# EAGLE design LoLin32-Lite-Lora (EAGLE 7.7.0)
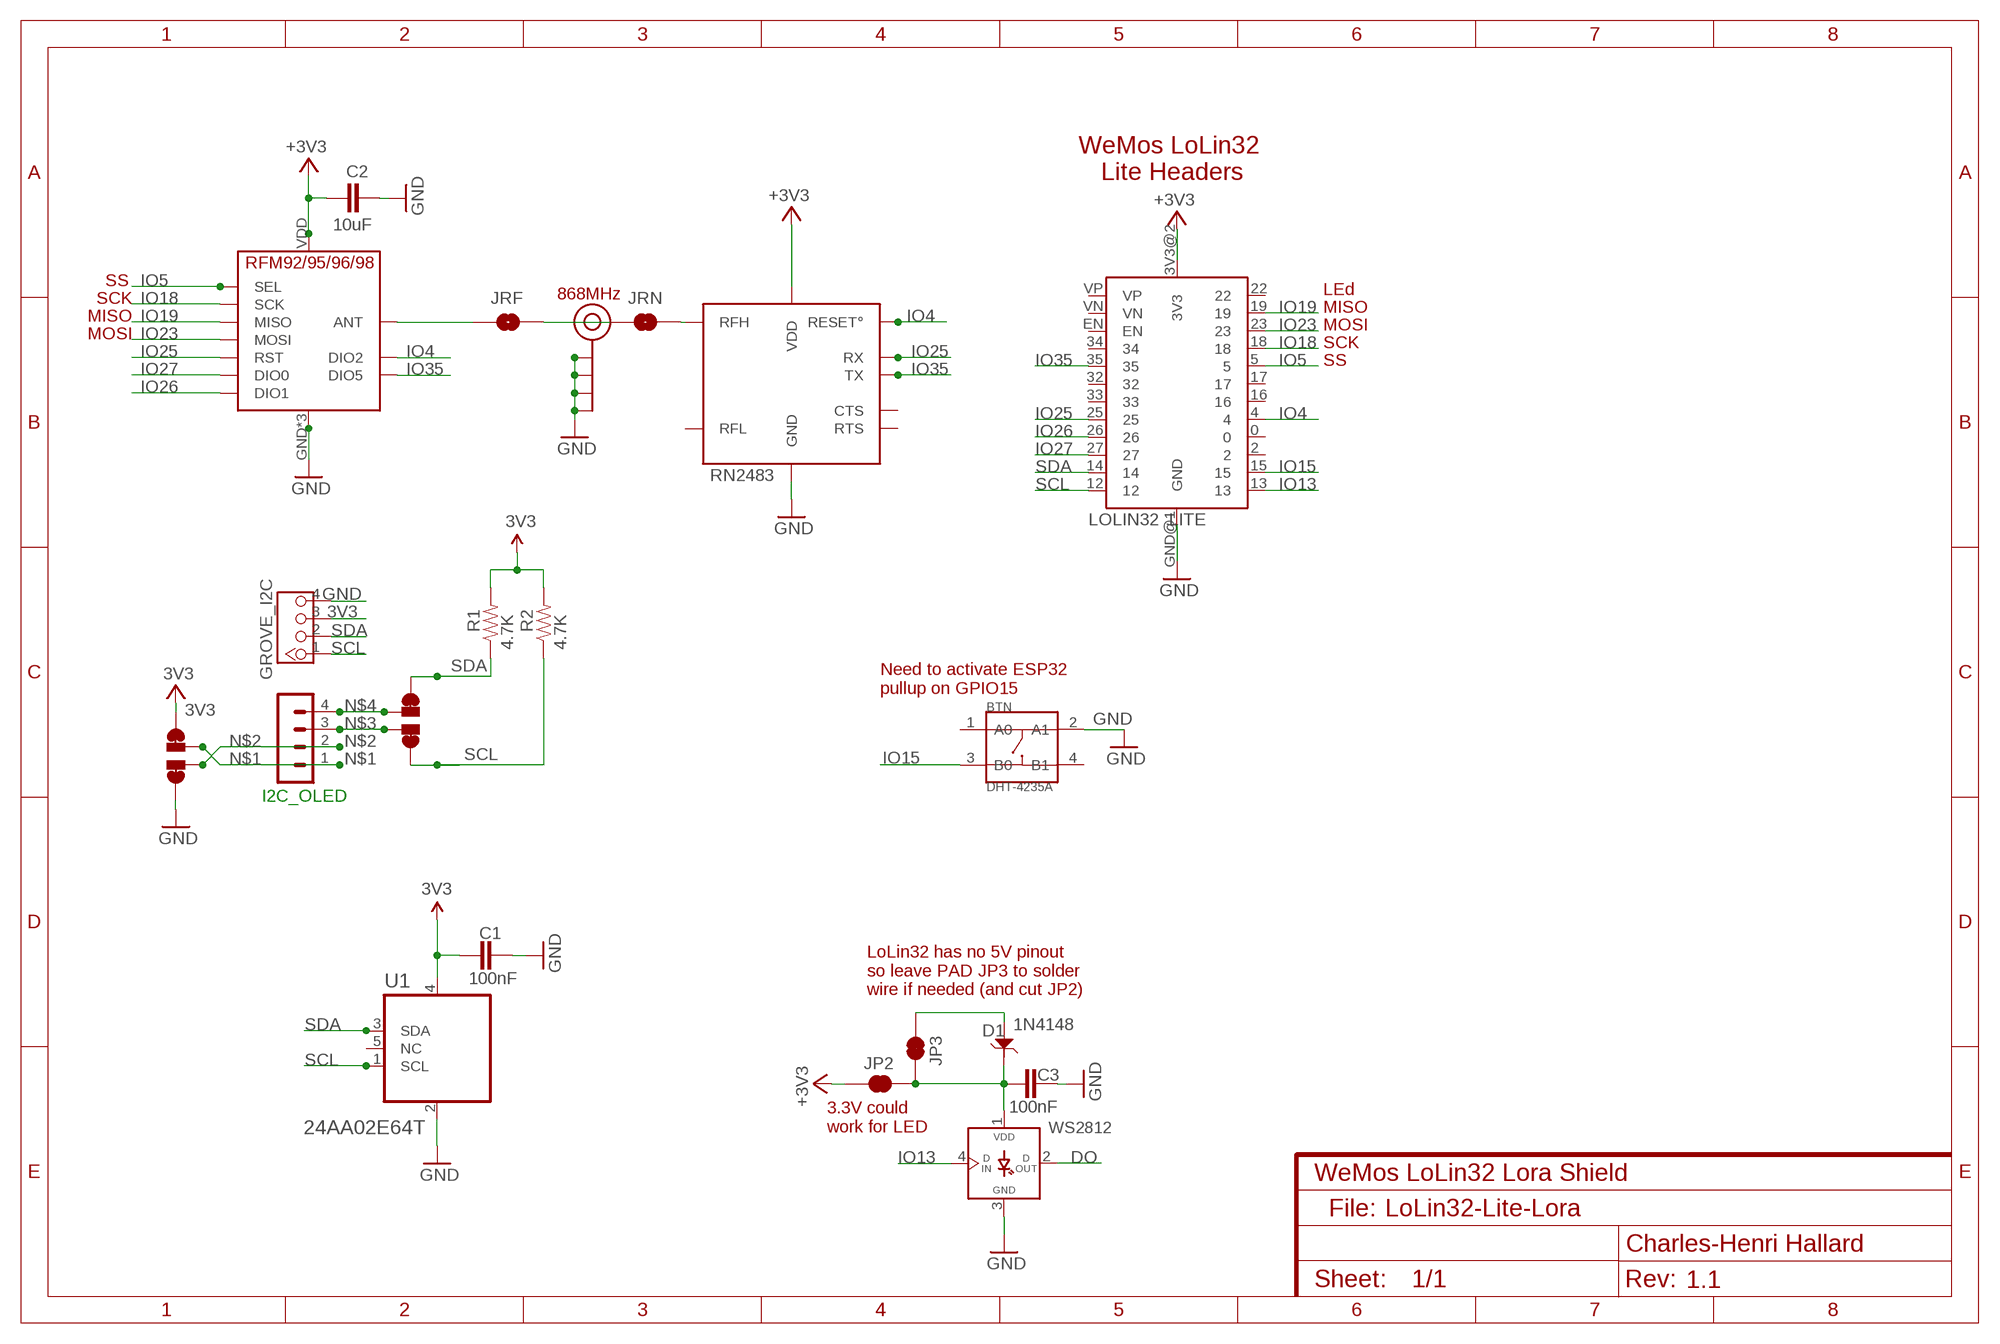
[diagram p0: schematic, sheet 1]
NAME (FRAME-A4L): CNAME: WeMos LoLin32 Lora Shield; CREVISION: 1.1; DESIGNER: Charles-Henri Hallard

## Parts
BTN  DHT-4235A  SMD-BUTTON-TOP-DHT-4235A(4P-4.2X3.2MM)  [SW4-SMD-4.2X3.2X2.5MM]
C1  100nF  CAP0805-CAP  [0805-CAP]
C2  10uF  CAP0805-CAP-LARGEPADS  [0805-CAP-LARGEPADS]
C3  100nF  CAP0805-CAP  [0805-CAP]
D1  1N4148  D-ESD-2P-CESD5V0D1  [SOD123-2.7X1.6]
GROVE_I2C  4P-2.0  GROVE-CONNECTOR-DIP(4P-2.0)  [HW4-2.0]
I2C_OLED  CON_HEADER_1X04'NO_LOCK'  [1X04_NO_LOCK]
J$2  ANTENNATINY  [SMA_UFL_PAD_TINY]
JP2  RXLED  JUMPER-PAD-2-NC_BY_TRACE  [PAD-JUMPER-2-NC_BY_TRACE_YES_SILK]
JP3  JUMPER-PAD-2-NC_BY_TRACE  [PAD-JUMPER-2-NC_BY_TRACE_YES_SILK]
JRF  JUMPER-PAD-2-NO  [PAD-JUMPER-2-NO_NO_SILK]
JRN  JUMPER-PAD-2-NO  [PAD-JUMPER-2-NO_NO_SILK]
R1  4.7K  RESISTOR0805-RES  [0805-RES]
R2  4.7K  RESISTOR0805-RES  [0805-RES]
U1  24AA02E64T  24AA02E64T-I/OT  [SOT95P270X145-5N]
U$1  LOLIN32 LITE  LOLIN32_LITELITE  [LOLIN32_LITE]
U$2  PAD-JUMPER-SWAPSWAP  [PAD-JUMPER-SWAP]
U$3  PAD-JUMPER-SWAPSWAP  [PAD-JUMPER-SWAP]
U$5  RFM95  [RFM95]
U$7  RN2483  RN2483_NOGPIO868  [RN2483_NOGPIO_868]
WS2812  WS2812B  WS2812BSMD  [WS2812B]

## Nets
3V3: C1.1 C2.2 GROVE_I2C.3 JP2.2 R1.2 R2.2 U1.4(VCC) U$1.3V3@2(3V3) U$2.4 U$2.44 U$5.VDD(VCC) U$7.VDD U$7.VDD2(VDD) ; supply symbol labelled +3V3
5V: D1.1 JP3.2
DO: WS2812.2(DOUT)
GND: BTN.2(A1) C1.2 C2.1 C3.2 GROVE_I2C.4 J$2.GND1(GND) J$2.GND2(GND) J$2.GND3(GND) J$2.GND4(GND) U1.2(VSS) U$1.GND@1(GND) U$2.1 U$2.11 U$5.GND U$5.GND1(GND) U$5.GND2(GND) U$7.GND U$7.GND3(GND) U$7.GND4(GND) U$7.GND7(GND) U$7.GND9(GND) U$7.GND11(GND) U$7.GND12(GND) WS2812.3(GND)
IO4: U$1.4 U$5.DIO2 U$7.RESET°
IO5: U$1.5 U$5.NSS(SEL)
IO13: U$1.13 WS2812.4(DIN)
IO15: BTN.3(B0) U$1.15
IO18: U$1.18 U$5.SCK
IO19: U$1.19 U$5.MISO
IO23: U$1.23 U$5.MOSI
IO25: U$1.25 U$5.RST U$7.UART_RX(RX)
IO26: U$1.26 U$5.DIO1
IO27: U$1.27 U$5.DIO0
IO35: U$1.35 U$5.DIO5 U$7.UART_TX(TX)
N$1: I2C_OLED.1 U$2.3
N$2: I2C_OLED.2 U$2.2
N$3: I2C_OLED.3 U$3.2
N$4: I2C_OLED.4 U$3.3
N$5: JRN.2 U$7.RFH
N$6: JRF.1 U$5.ANT
N$7: J$2.ANT1(SIGNAL) J$2.ANT2(SIGNAL) J$2.ANT3(SIGNAL) JRF.2 JRN.1
SCL: GROVE_I2C.1 R2.1 U1.1(SCL) U$1.12 U$3.1 U$3.11
SDA: GROVE_I2C.2 R1.1 U1.3(SDA) U$1.14 U$3.4 U$3.44
VLED: C3.1 D1.2 JP2.1 JP3.1 WS2812.1(VDD)
Unconnected: BTN.1(A0) BTN.4(B1) U1.5(NC) U$1.0 U$1.2 U$1.16 U$1.17 U$1.22 U$1.32 U$1.33 U$1.34 U$1.EN U$1.VN U$1.VP U$7.RFL U$7.UART_CTS(CTS) U$7.UART_RTS(RTS)

## Notes on the sheet
- WeMos LoLin32 
  Lite Headers
- SS
- 868MHz | LEd
- SCK
- MISO
- MISO
- MOSI
- MOSI
- SCK
- SS
- Need to activate ESP32
  pullup on GPIO15
- LoLin32 has no 5V pinout
  so leave PAD JP3 to solder
  wire if needed (and cut JP2)
- 3.3V could
  work for LED
- File:

## Library data of the parts
BTN = Switch-2016:SMD-BUTTON-TOP-DHT-4235A(4P-4.2X3.2MM): 311020045; MPN: DHT-4235A
C1-C3 = _c2h:CAP: Capacitor Standard 0603 ceramic capacitor, and 0.1" leaded capacitor.
D1 = Seeed-Discrete:D-ESD-2P: Diodes for Protectiong against ESD
GROVE_I2C = _c2h:GROVE-CONNECTOR-DIP(4P-2.0): 320110033
I2C_OLED = _c2h:CON_HEADER_1X04
J$2 = _c2h:ANTENNA: SMA Antenna Connector End launch SMA connector. The paste layer has been removed so that the connector can be hand soldered onto the board after reflow.
JP2 JP3 = SparkFun-Passives:JUMPER-PAD-2-NC_BY_TRACE
JRF JRN = SparkFun-Passives:JUMPER-PAD-2-NO
R1 R2 = _c2h:RESISTOR: Resistor Basic schematic elements and footprints for 0603, 1206, and PTH resistors.
U1 = Microchip-24AA02E64T:24AA02E64T-I/OT: 2K I2C™ Serial EEPROMs, SOT23-5; MPN: 24AA02E64T-I/OT; OC_FARNELL: 2345567; OC_NEWARK: 01X0461; PACKAGE: SOT23-5; SUPPLIER: Microchip
U$1 = _c2h:LOLIN32_LITE
U$2 U$3 = _c2h:PAD-JUMPER-SWAP
U$5 = _c2h:RFM95
U$7 = _c2h:RN2483_NOGPIO
WS2812 = _c2h:WS2812B

## Net classes
0 default: width 0.203 mm, drill 0.356 mm, clearance 0.152 mm
1 power: width 0.203 mm, clearance 0.152 mm

## Board
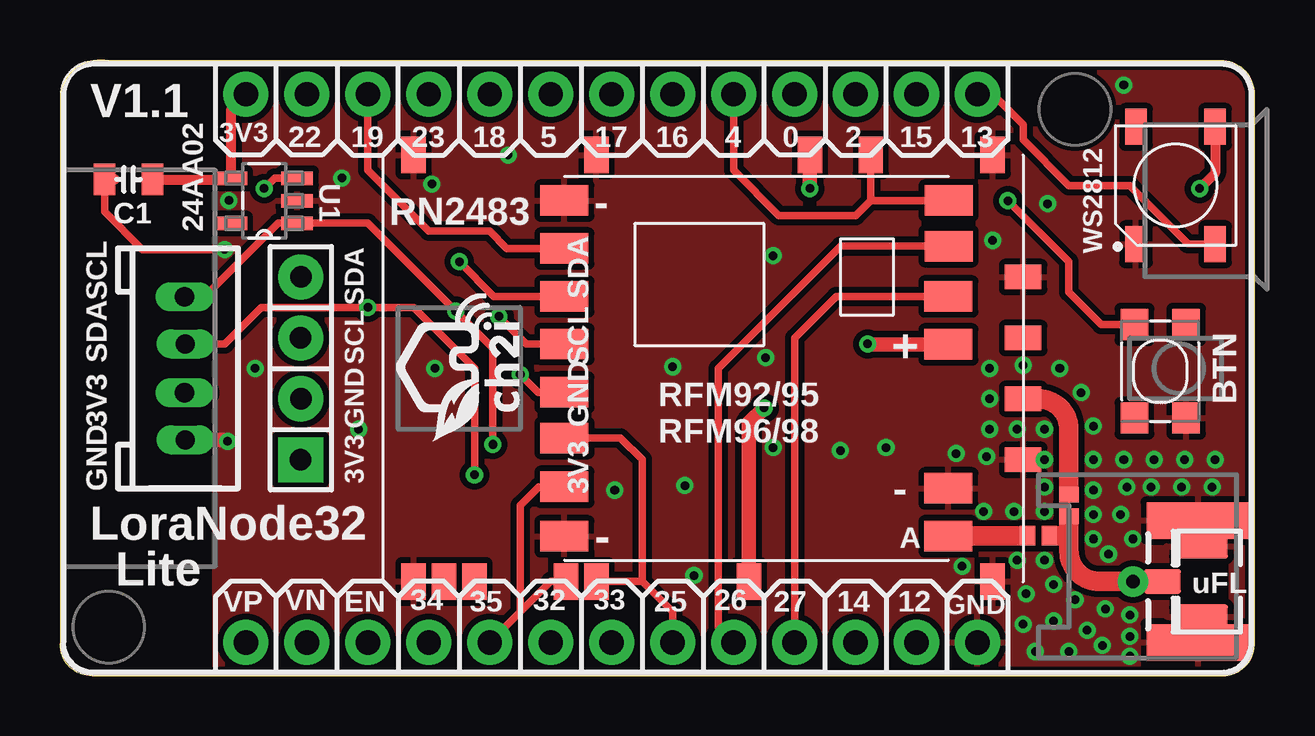
[diagram p1: board, top side]
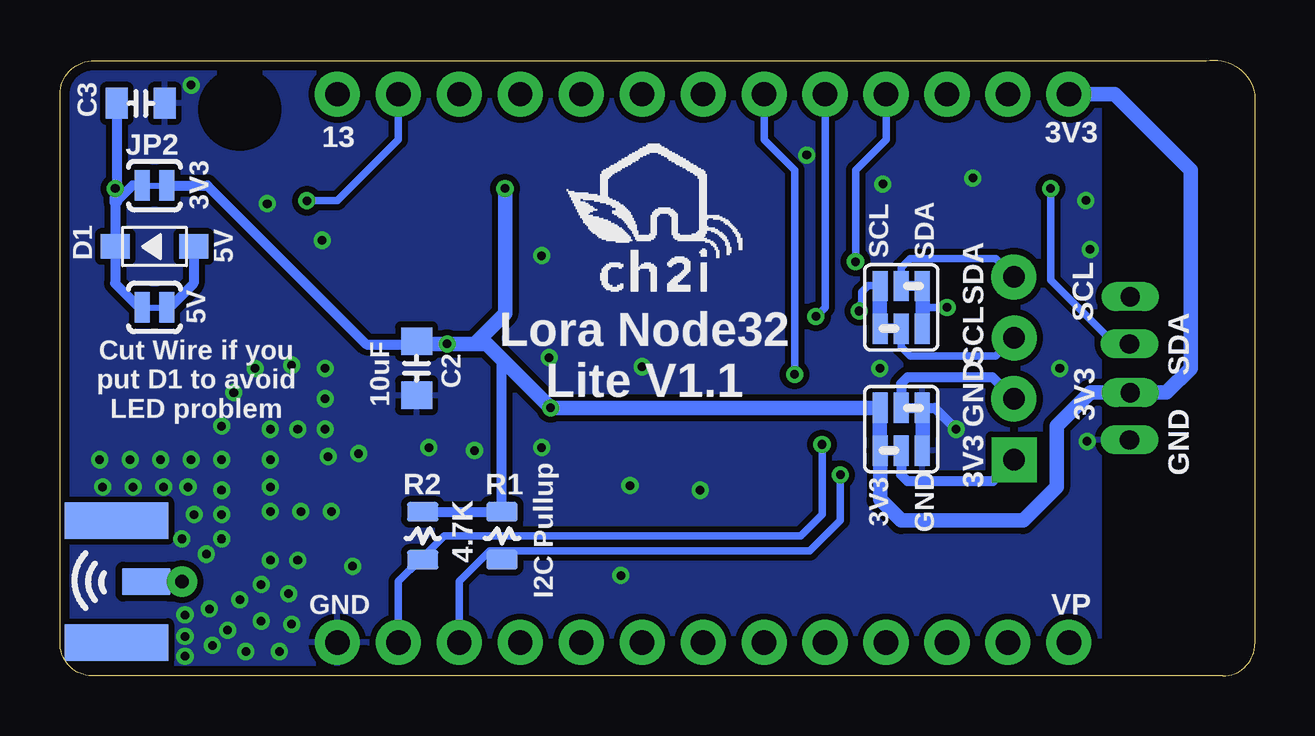
[diagram p2: board, bottom side, seen from below]

Size 49.78 x 25.68 mm. Coordinates in mm from the lower left corner, seen from the top.
Outline: 48.36,25.65 2.03,25.65 arc90 0,24.26 0,1.33 arc90 1.33,0 48.45,0 arc90 49.78,1.4 49.78,24.26 arc90 48.36,25.65
Copper layers (1*16): Top 0.0356mm / dielectric 1.5011mm / Bottom 0.0356mm
Design rules "PCBs_io": minimum track width 6mil, minimum drill 13mil, track to track 6mil, track to pad 6mil, pad to pad 6mil, via to via 6mil, smd to smd 6mil, copper to edge 15mil, drill to drill 6mil, minimum pad ring 7mil, minimum via ring 7mil, stop-mask expansion 3mil, vias tented up to drill 40mil, thermal gap 10mil
tRestrict: area 0.8,0.8 to 3.3,3.3; area 41,22.4 to 43.6,24.9
bRestrict: area 0.8,0.8 to 3.3,3.3; area 41,22.4 to 43.6,24.9

### Footprints (pad centres in the part's own frame; a part is rotated, then mirrored left to right if it is on the bottom)
SW4-SMD-4.2X3.2X2.5MM = smd 1.3 x 1.15: 1 -1.95,1.075; 2 1.95,1.075; 3 -1.95,-1.075; 4 1.95,-1.075
0805-CAP = smd 0.902 x 1.3: 1 -1,0; 2 1,0
0805-CAP-LARGEPADS = smd 1.156 x 1.3: 1 -1.127,0; 2 1.127,0
SOD123-2.7X1.6 = smd 1.2 x 1.02: 1 -1.635,0; 2 1.635,0
HW4-2.0 = drill 0.8 pad 1.143 long: 1 -2.985,-0.015; 2 -1.016,0.016; 3 1.016,-0.016; 4 2.985,0.015
1X04_NO_LOCK = drill 0.9 pad 1.88 square: 1 -3.816,-0.121 | drill 0.9 pad 1.88: 2 -1.27,-0.133; 3 1.27,-0.121; 4 3.81,-0.133
SMA_UFL_PAD_TINY = smd 1.524 x 1.016: ANT1 -3.843,0 | drill 0.559 pad 1.27: ANT2 -5.08,0 | smd 2.032 x 1.143 bottom: ANT3 -3.589,0 | smd 2.2 x 1.016: GND1 -2.223,1.47; GND2 -2.223,-1.47 | smd 4.318 x 1.524: GND3 -2.349,-2.54; GND4 -2.349,2.54 | smd 4.318 x 1.524 bottom: GND5 -2.349,2.54; GND6 -2.349,-2.54
PAD-JUMPER-2-NC_BY_TRACE_YES_SILK = smd 0.635 x 1.27: 1 -0.508,0; 2 0.508,0
PAD-JUMPER-2-NO_NO_SILK = smd 0.635 x 0.813: 1 -0.45,0; 2 0.45,0
0805-RES = smd 0.8 x 1.3: 1 -1,0; 2 1,0
SOT95P270X145-5N = smd 1.321 x 0.559: 1 -1.372,0.94; 2 -1.372,0; 3 -1.372,-0.94; 4 1.372,-0.94; 5 1.372,0.94
LOLIN32_LITE = drill 1.016 pad 1.88: 0 11.43,-0.635; 2 11.43,-3.175; 3V3@2 11.43,22.225; 4 11.43,1.905; 5 11.43,9.525; 12 -11.43,-5.715; 13 11.43,-8.255; 14 -11.43,-3.175; 15 11.43,-5.715; 16 11.43,4.445; 17 11.43,6.985; 18 11.43,12.065; 19 11.43,17.145; 22 11.43,19.685; 23 11.43,14.605; 25 -11.43,4.445; 26 -11.43,1.905; 27 -11.43,-0.635; 32 -11.43,9.525; 33 -11.43,6.985; 34 -11.43,14.605; 35 -11.43,12.065; EN -11.43,17.145; GND@1 -11.43,-8.255; VN -11.43,19.685; VP -11.43,22.225
PAD-JUMPER-SWAP = smd 0.635 x 1.27: 1 -0.876,0.889; 2 0,-0.889; 3 0,0.889; 4 0.876,-0.889; 11 -0.876,-0.889; 44 0.876,0.889
RFM95 = smd 2 x 1.27: ANT 5.777,-7; DIO0 5.777,3; DIO1 5.779,5.095; DIO2 5.779,7; DIO5 -10.225,-4.936; GND 5.777,-5; GND1 -10.223,7; GND2 -10.23,-7; MISO -10.23,5; MOSI -10.225,3; NSS -10.223,-1; RST -10.223,-2.905; SCK -10.23,1.012; VDD 5.777,1
RN2483_NOGPIO_868 = smd 1.524 x 1.016: GND 17.78,1.27; GND3 17.78,25.4; GND9 0,25.4; GND11 0,8.89; GND12 0,1.27; RESET° 0,20.32; UART_CTS 17.78,3.81; UART_RTS 17.78,2.54; UART_RX 17.78,8.89; UART_TX 17.78,7.62; VDD 17.78,15.24; VDD2 0,17.78 | smd 1.016 x 1.524: GND4 12.7,26.67; GND7 5.08,26.67; RFH 10.16,26.67; RFL 7.62,26.67
WS2812B = smd 1.5 x 0.9: 1 2.45,-1.65; 2 2.45,1.65; 3 -2.45,1.65; 4 -2.45,-1.65

### Placement (x,y rotation side)
BTN  45.85,12.7 270 top
C1  2.86,20.7 180 top
C2  34.93,12.83 90 bottom
C3  46.42,23.88 0 bottom
D1  45.85,17.91 180 bottom
GROVE_I2C  5.21,12.83 270 top
I2C_OLED  9.91,12.83 90 top
J$2  49.78,3.94 0 top
JP2  45.85,20.45 0 bottom
JP3  45.85,15.37 0 bottom
JRF  40.77,5.84 0 top
JRN  42.04,7.11 90 top
R1  31.37,5.84 90 bottom
R2  34.67,5.84 90 bottom
U1  8.51,19.81 180 top
U$1  29.97,12.83 90 top
U$2  14.73,10.29 180 bottom
U$3  14.73,15.37 0 bottom
U$4  [LOGO_CH2I_75MM]  24.57,18.03 0 bottom
U$5  31.24,12.83 0 top
U$6  [LOGO_C2I_015]  19.18,9.78 90 top
U$7  13.46,21.72 270 top
WS2812  46.48,20.45 90 top

### Tracks (layer width: path | path; a pad name or v marks a point on that pad's centre or on a via)
3V3  (via drill 0.36 pad 0.71)
  Top 0.406: C1.1 7.09,20.7 U1.4 7.14,23.65 U$1.3V3@2
  Top 0.61: U$7.VDD 28.7,10.54 v29.34,11.18 | U$5.VDD 33.67,13.83 v33.66,13.84 | U$7.VDD2 v31.24,20.32
  Bottom 0.406: 15.62,11.19 U$2.4 U$2.44 | R2.2 R1.2 31.37,13.21 31.43,13.27 | JP2.2 43.64,20.45 U$5.VDD 33.67,13.83 v33.66,13.84
  Bottom 0.61: U$2.4 v29.34,11.18 31.43,13.27 32,13.84 32.51,13.84 | U$2.44 15.61,7.35 14.73,6.48 9.65,6.48 8.26,7.87 8.26,10.41 6.86,11.81 GROVE_I2C.3 3.68,11.81 2.67,12.83 2.67,21.08 5.84,24.26 U$1.3V3@2 | C2.2 34.81,13.84 v33.66,13.84 32.51,13.84 | v31.24,20.32 31.24,15.11 32.51,13.84
5V
  Bottom 0.406: D1.1 44.21,16.37 45.21,15.37 JP3.2
GND  (via drill 0.36, 0.36 pad 0.71)
  Top 0.305: v6.86,17.78 3.43,17.78 1.86,19.35 C1.2
  Top 0.406: C1.2 2.29,20.7
  Top 0.61: GROVE_I2C.4 6.92,9.84 v6.98,9.78
  Bottom 0.406: U$2.11 13.34,11.18 v12.45,10.29
  other vias: 26.42,4.19 8.13,12.83 34.42,9.53 45.59,9.02 25.53,12.89 41.4,2.29 42.8,1.91 43.43,1.27 44.45,7.87 45.47,7.87 44.32,9.02 44.7,5.71 43.56,2.79 44.58,2.54 44.58,1.65 44.58,0.83 46.74,7.87 48.01,7.87 46.86,9.02 48.13,9.02 42.04,1.02 40.64,1.02 40.13,2.16 32.51,9.4 26.04,7.94 41.15,19.68 37.34,9.27 38.86,18.16 29.4,13.27 29.72,17.53 11.75,20.76 15.62,12.83 18.67,21.72 29.72,9.53 23.11,7.75 15.49,20.51 7.04,19.82 43.69,5.08 43.05,5.71 43.05,6.73 43.05,7.75 41.66,12.83 41.02,7.87 41.02,6.86 41.02,4.83 41.4,3.81 42.29,3.17 40.26,3.43 39.88,4.83 39.75,6.86 38.48,6.86 37.59,4.57 42.55,11.81 38.73,11.56 38.61,9.14 38.73,10.29 41.02,9.02 43.05,9.02 43.05,10.41 40.13,12.95 38.73,12.83 39.88,10.29 41.02,10.29 44.2,6.73 44.32,24.64
  pour Bottom (isolate 0.254): 50.93,26.8 50.93,-1.14 6.48,-1.14 6.48,26.8
  pour Top (isolate 0.254): 6.48,26.16 50.29,26.16 50.29,-0.51 6.48,-0.51
IO4
  Top 0.305: U$1.4 28.07,21.08 29.96,19.19 33.16,19.19 33.78,19.81 | 33.78,19.81 U$7.RESET° | U$5.DIO2 33.8,19.83 33.78,19.81
IO5  (via drill 0.36 pad 0.71)
  Top 0.305: U$5.NSS 19.92,11.83 v19.18,12.57
  Bottom 0.305: v19.18,12.57 19.18,21.08 20.45,22.35 U$1.5
IO13
  Top 0.305: WS2812.4 46.99,18.04 44.58,20.45 42.04,20.45 40.13,22.35 40.13,22.99 38.86,24.26 U$1.13
IO15  (via drill 0.36 pad 0.71)
  Top 0.305: v39.5,19.81 42.04,17.27 42.04,16 43.39,14.65 BTN.3
  Bottom 0.305: U$1.15 35.69,22.35 38.23,19.81 v39.5,19.81
IO18  (via drill 0.36 pad 0.71)
  Top 0.305: U$5.SCK 19.43,13.84 v18.29,14.99
  Bottom 0.305: v18.29,14.99 17.91,15.37 U$1.18
IO19
  Top 0.305: U$1.19 12.83,21.08 15.37,18.54 17.91,18.54 18.62,17.83 U$5.MISO
IO23  (via drill 0.36 pad 0.71)
  Top 0.305: U$5.MOSI 18.08,15.83 v16.64,17.27
  Bottom 0.305: v16.64,17.27 16.64,21.08 15.37,22.35 U$1.23
IO25
  Top 0.305: U$7.UART_RX 24.26,3.94 | 24.26,3.94 25.53,2.67 U$1.25 | U$5.RST 23.35,9.92 24.26,9.02 24.26,3.94
IO26
  Top 0.305: U$5.DIO1 32.53,17.92 27.43,12.83 27.43,2.03 U$1.26
IO27
  Top 0.305: U$5.DIO0 32.34,15.83 30.61,14.1 U$1.27
IO35
  Top 0.305: U$5.DIO5 19.95,7.89 19.18,7.11 19.18,2.67 | 19.18,2.67 U$1.35 | U$7.UART_TX 20.45,3.94 19.18,2.67
N$1
  Bottom 0.406: U$2.3 14.73,8.38 14.48,8.13 10.91,8.13 I2C_OLED.1
N$2
  Bottom 0.406: U$2.2 14.73,12.19 14.48,12.45 10.93,12.45 I2C_OLED.2
N$3
  Bottom 0.305: U$3.2 14.73,13.72 14.35,13.34 10.79,13.34 I2C_OLED.3
N$4
  Bottom 0.305: U$3.3 14.73,17.02 14.35,17.4 10.8,17.4 I2C_OLED.4
N$5
  Top 0.61: JRN.2 42.04,7.87
  Top 0.813: 42.04,7.87 42.04,10.29 arc90 40.77,11.56 U$7.RFH
N$6
  Top 0.61: JRF.1 40.13,5.84
  Top 0.813: 40.13,5.84 37.03,5.84 arc90 U$5.ANT
N$7
  Top 0.61: JRN.1 42.04,6.48 | JRF.2 41.4,5.84
  Top 0.813: 42.04,6.48 42.04,5.84 | 42.04,5.84 42.04,5.21 arc90 43.31,3.94 J$2.ANT2 J$2.ANT1 | 41.4,5.84 42.04,5.84
  Bottom 0.813: J$2.ANT3 J$2.ANT2
SCL  (via drill 0.36 pad 0.71)
  Top 0.305: GROVE_I2C.1 6.03,15.81 9.09,18.87 U1.1 12.83,18.87 v16.48,15.21 18.03,13.67 v18.03,9.65
  Bottom 0.305: U$3.11 U$3.1 15.62,16.27 16.12,16.27 16.38,16 16.38,15.62 v16.48,15.21 | U$1.12 35.69,3.94 34.78,4.84 | 34.78,4.84 33.78,5.84 18.92,5.84 18.03,6.73 v18.03,9.65 | R2.1 34.78,4.84
SDA  (via drill 0.36 pad 0.71)
  Top 0.305: GROVE_I2C.2 6.86,13.84 8.38,15.37 v12.83,15.37 14.73,15.37 17.27,12.83 v17.27,8.38 | U1.3 8.94,20.75 v8.51,20.32
  Bottom 0.305: U$3.44 13.86,15.37 | 13.86,15.37 U$3.4 | U$1.14 33.15,3.94 31.88,5.21 31.24,5.21 | 31.24,5.21 18.54,5.21 17.27,6.48 v17.27,8.38 | v8.51,20.32 8.51,16.51 5.84,13.84 GROVE_I2C.2 | v12.83,15.37 13.86,15.37 | R1.1 31.37,5.08 31.24,5.21
VLED  (via drill 0.36 pad 0.71)
  Top 0.406: WS2812.1 48.13,20.97 v47.48,20.32
  Bottom 0.406: JP3.1 46.48,15.37 47.48,16.37 D1.2 | v47.48,20.32 D1.2 | 47.53,17.86 D1.2 | JP2.1 46.77,20.45 47.37,19.85 47.5,19.7 v47.48,20.32 | C3.1 47.42,19.75 v47.48,20.32

### Text on the board
tNames: V1.1 | 24AA02 | SDA | SCL | SDA | SCL | SDA | SCL | RFM92/95 / RFM96/98 | GND | 3V3 | GND | 3V3 | GND | 3V3 | LoraNode32 | Lite
bNames: 3V3 | SDA | SCL | 5V | SDA | SCL | SDA | 5V | SCL | Lora Node32 / Lite V1.1 | Cut Wire if you / put D1 to avoid / LED problem | GND | 3V3 | GND | 3V3 | GND | 3V3 | I2C Pullup